# EAGLE schematic nc7wp14-breakout (EAGLE 5.10)
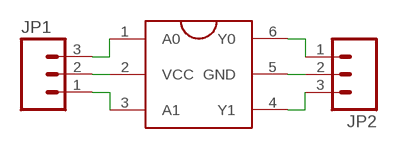
[diagram p0: schematic, sheet 1]

## Parts
JP1  M03LOCK_LONGPADS  [1X03_LOCK_LONGPADS]
JP2  M03LOCK_LONGPADS  [1X03_LOCK_LONGPADS]
U$1  NC7WP14P6X  [SC70-6L]

## Nets
N$1: JP1.1 U$1.3(A1)
N$2: JP1.2 U$1.2(VCC)
N$3: JP1.3 U$1.1(A0)
N$4: JP2.3 U$1.4(Y1)
N$5: JP2.2 U$1.5(GND)
N$6: JP2.1 U$1.6(Y0)

## Library data of the parts
JP1 JP2 = SparkFun:M03: Header 3 Standard 3-pin 0.1" header. Use with straight break away headers (SKU : PRT-00116), right angle break away headers (PRT-00553), swiss pins (PRT-00743), machine pins (PRT-00117), and female headers (PRT-00115). Molex polarized connector foot print use with SKU : PRT-08232 with associated crimp pins and housings.
U$1 = ideabot:NC7WP14P6X